# EAGLE schematic DeviceRelay8 (EAGLE 5.00)
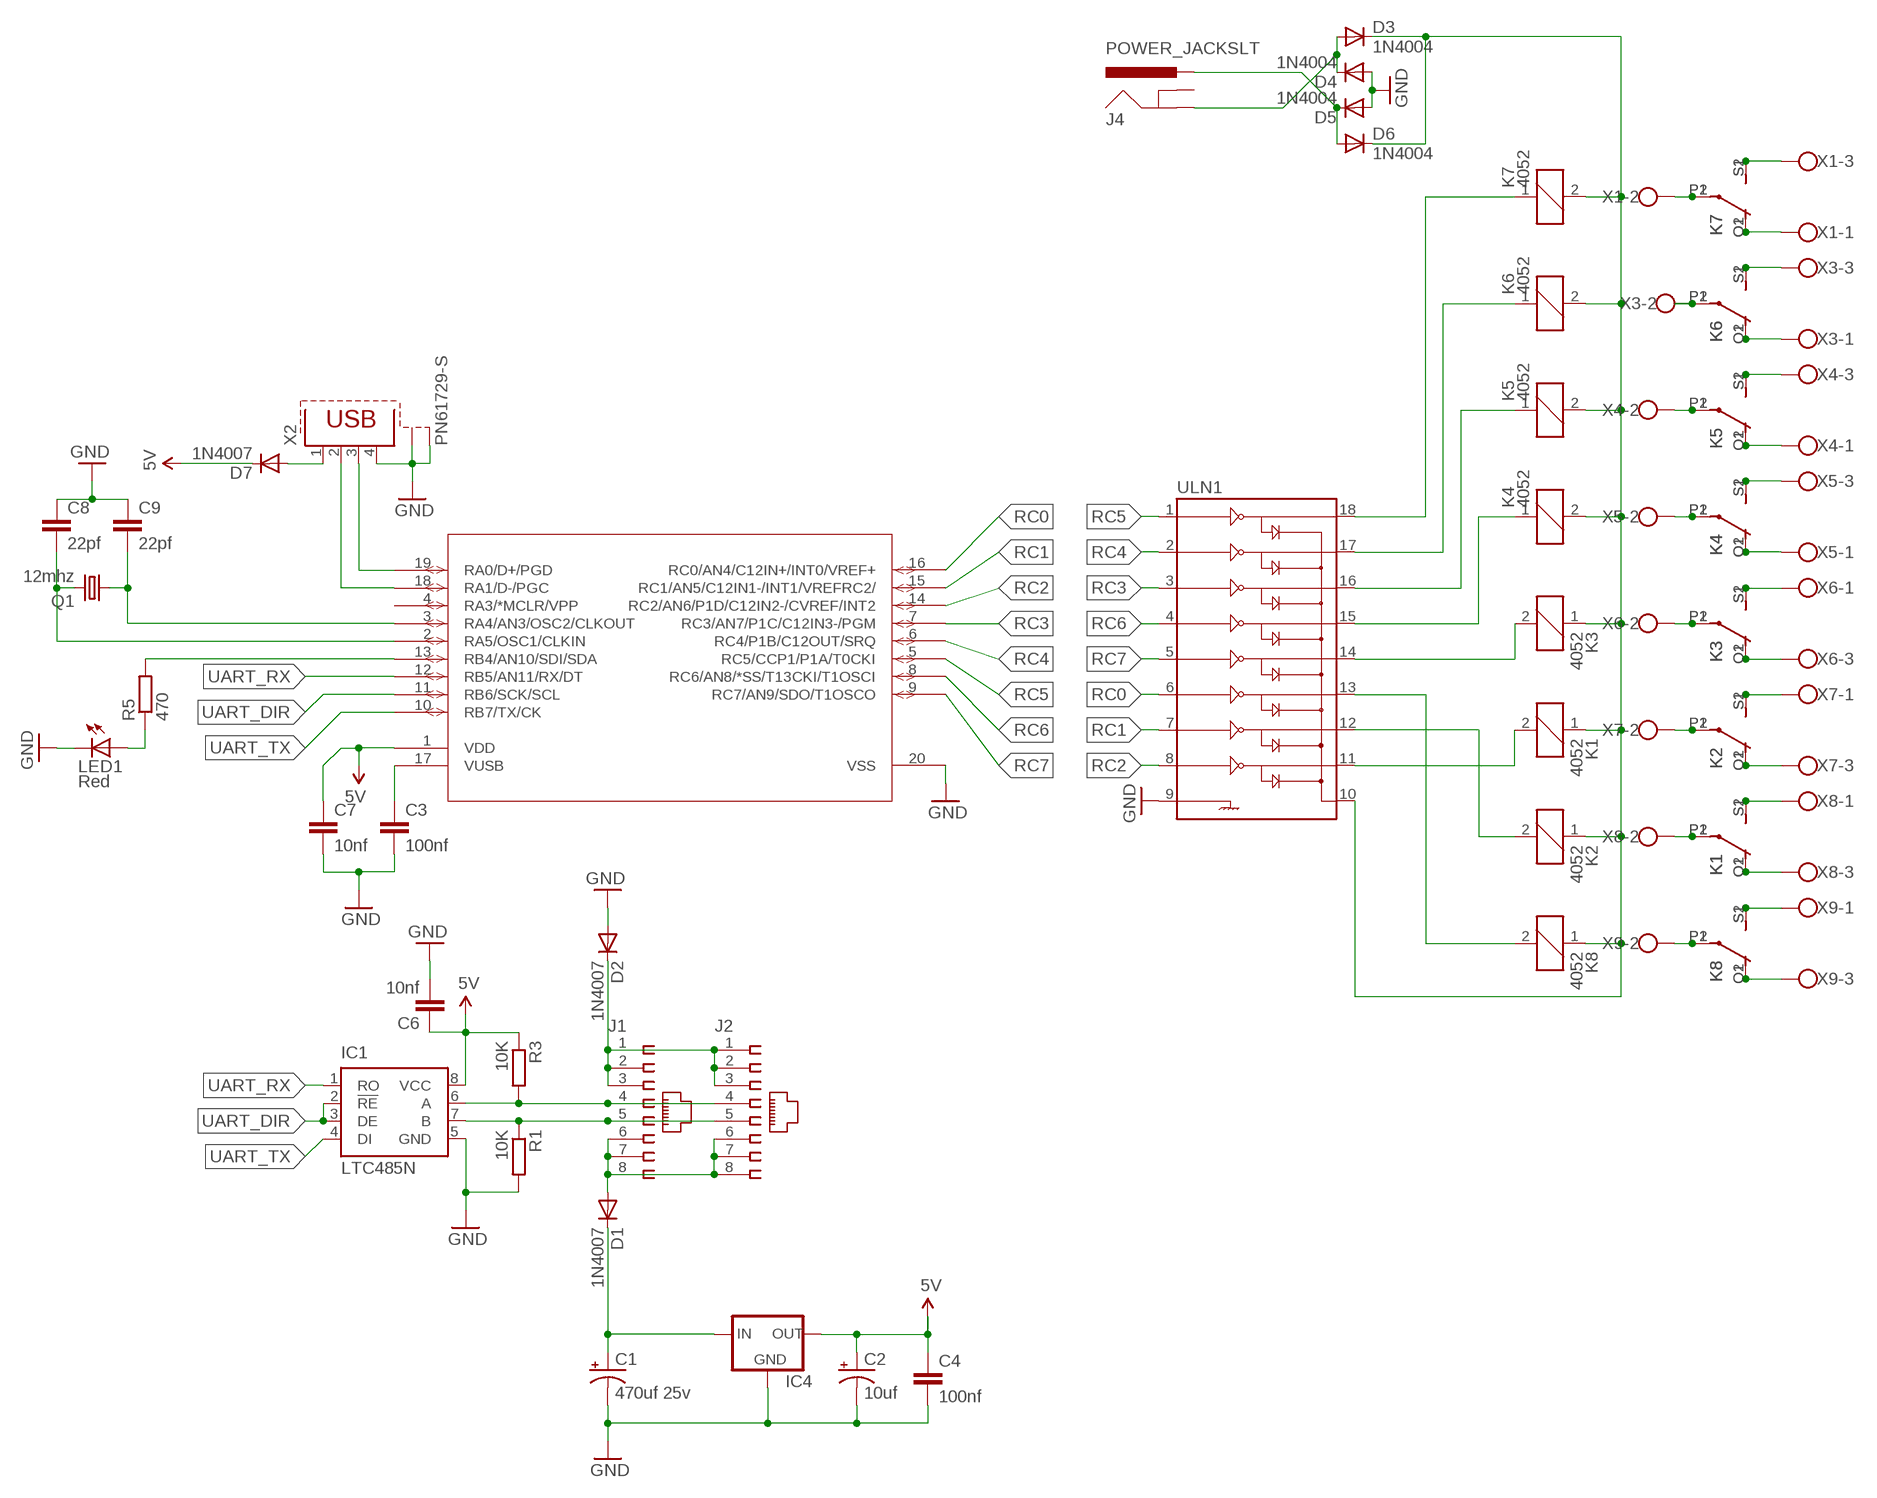
[diagram p0: schematic, sheet 1]

## Parts
C1  470uf 25v  CAP_POLPTH1  [CPOL-RADIAL-100UF-25V]
C2  10uf  CAP_POLPTH1  [CPOL-RADIAL-100UF-25V]
C3  100nf  C5/2.5  [C5B2.5]
C4  100nf  C5/2.5  [C5B2.5]
C6  10nf  C5/2.5  [C5B2.5]
C7  10nf  C5/2.5  [C5B2.5]
C8  22pf  C5/2.5  [C5B2.5]
C9  22pf  C5/2.5  [C5B2.5]
D1  1N4007  DIODE-D-7.5  [D-7.5]
D2  1N4007  DIODE-D-7.5  [D-7.5]
D3  1N4004  [DO41-10]
D4  1N4004  [DO41-10]
D5  1N4004  [DO41-10]
D6  1N4004  [DO41-10]
D7  1N4007  DIODE-D-7.5  [D-7.5]
IC1  LTC485N  [DIL08]
IC4  78XXL  [78XXL]
J1  215877-4  [215877-4]
J2  215877-4  [215877-4]
J4  POWER_JACKSLT  [POWER_JACK_SLOT]
K1  4052  [F4052]
K2  4052  [F4052]
K3  4052  [F4052]
K4  4052  [F4052]
K5  4052  [F4052]
K6  4052  [F4052]
K7  4052  [F4052]
K8  4052  [F4052]
LED1  Red  LED5MM  [LED5MM]
Q1  12mhz  CRYSTALHC49U-V  [HC49U-V]
R1  10K  R-EU_0204/5  [0204/5]
R3  10K  R-EU_0204/5  [0204/5]
R5  470  R-EU_0207/7  [0207/7]
U$2  PIC18F14K50-E-P  [PIC18F14K50-E/P]
ULN1  ULN2803DIP  [DIL18]
X1  W237-103  [W237-103]
X2  PN61729-S  [PN61729-S]
X3  W237-103  [W237-103]
X4  W237-103  [W237-103]
X5  W237-103  [W237-103]
X6  W237-103  [W237-103]
X7  W237-103  [W237-103]
X8  W237-103  [W237-103]
X9  W237-103  [W237-103]

## Nets
5V: C2.1(+) C4.1 C6.1 C7.1 D7.C IC1.8(VCC) IC4.OUT R3.1 U$2.1(VDD)
GND: C1.2(-) C2.2(-) C3.2 C4.2 C6.2 C7.2 C8.1 C9.1 D2.A D4.A D5.A IC1.5(GND) IC4.GND LED1.K(C) R1.2 U$2.20(VSS) ULN1.9 X2.4 X2.S1 X2.S2
N$1: LED1.A R5.1
N$2: D1.A J1.6 J1.7 J1.8 J2.6 J2.7 J2.8
N$3: IC1.6(A) J1.4 J2.4 R3.2
N$4: R5.2 U$2.13(RB4/AN10/SDI/SDA)
N$5: C1.1(+) D1.C IC4.IN
N$9: D2.C J1.1 J1.2 J1.3 J2.1 J2.2 J2.3
N$11: U$2.18(RA1/D-/PGC) X2.2
N$12: C3.1 U$2.17(VUSB)
N$13: U$2.19(RA0/D+/PGD) X2.3
N$14: K1.2 ULN1.11
N$15: D7.A X2.1
N$17: K8.2 ULN1.13
N$18: D5.C D6.A J4.PWR
N$20: K4.1 ULN1.15
N$21: K5.1 ULN1.16
N$22: K6.1 ULN1.17
N$23: K2.2 ULN1.12
N$24: K7.1 ULN1.18
N$25: K7.S1(2:S) K7.S2(3:S) X1.3
N$26: K7.O1(2:O) K7.O2(3:O) X1.1
N$27: K7.P1(2:P) K7.P2(3:P) X1.2
N$28: K6.P1(2:P) K6.P2(3:P) X3.2
N$29: K5.P1(2:P) K5.P2(3:P) X4.2
N$30: K4.P1(2:P) K4.P2(3:P) X5.2
N$31: K2.P1(2:P) K2.P2(3:P) X7.2
N$32: K1.P1(2:P) K1.P2(3:P) X8.2
N$33: K8.P1(2:P) K8.P2(3:P) X9.2
N$34: K8.O1(2:O) K8.O2(3:O) X9.3
N$35: K8.S1(2:S) K8.S2(3:S) X9.1
N$36: K1.S1(2:S) K1.S2(3:S) X8.1
N$37: K2.O1(2:O) K2.O2(3:O) X7.3
N$38: K2.S1(2:S) K2.S2(3:S) X7.1
N$39: K3.O1(2:O) K3.O2(3:O) X6.3
N$40: K6.O1(2:O) K6.O2(3:O) X3.1
N$41: K6.S1(2:S) K6.S2(3:S) X3.3
N$42: K1.O1(2:O) K1.O2(3:O) X8.3
N$43: K3.S1(2:S) K3.S2(3:S) X6.1
N$44: K4.O1(2:O) K4.O2(3:O) X5.1
N$45: K4.S1(2:S) K4.S2(3:S) X5.3
N$46: K5.O1(2:O) K5.O2(3:O) X4.1
N$47: K5.S1(2:S) K5.S2(3:S) X4.3
N$48: K3.P1(2:P) K3.P2(3:P) X6.2
N$50: IC1.7(B) J1.5 J2.5 R1.1
N$52: C8.2 Q1.2 U$2.2(RA5/OSC1/CLKIN)
N$53: C9.2 Q1.1 U$2.3(RA4/AN3/OSC2/CLKOUT)
N$54: K3.2 ULN1.14
N$57: D3.C D6.C K1.1 K2.1 K3.1 K4.2 K5.2 K6.2 K7.2 K8.1 ULN1.10
N$70: D3.A D4.C J4.GND@2(GND)
RC0: U$2.16(RC0/AN4/C12IN+/INT0/VREF+) ULN1.6
RC1: U$2.15(RC1/AN5/C12IN1-/INT1/VREFRC2/) ULN1.7
RC2: U$2.14(RC2/AN6/P1D/C12IN2-/CVREF/INT2) ULN1.8
RC3: U$2.7(RC3/AN7/P1C/C12IN3-/PGM) ULN1.3
RC4: U$2.6(RC4/P1B/C12OUT/SRQ) ULN1.2
RC5: U$2.5(RC5/CCP1/P1A/T0CKI) ULN1.1
RC6: U$2.8(RC6/AN8/*SS/T13CKI/T1OSCI) ULN1.4
RC7: U$2.9(RC7/AN9/SDO/T1OSCO) ULN1.5
UART_DIR: IC1.2(!RE) IC1.3(DE) U$2.11(RB6/SCK/SCL)
UART_RX: IC1.1(RO) U$2.12(RB5/AN11/RX/DT)
UART_TX: IC1.4(DI) U$2.10(RB7/TX/CK)
Unconnected: J4.GND@1(GNDBREAK) U$2.4(RA3/*MCLR/VPP)

## Library data of the parts
C1 C2 = SparkFun:CAP_POL: Capacitor Polarized These are standard SMD and PTH capacitors. Normally 10uF, 47uF, and 100uF in electrolytic and tantalum varieties. Always verify the external diameter of the through hole cap, it varies with capacity, voltage, and manufacturer. The EIA devices should be standard.
C3 C4 C6-C9 = capacitor-wima:C: CAPACITOR naming: grid - package width
D1 D2 D7 = diode:DIODE-: DIODE
D3-D6 = diode:1N4004: DIODE general purpose rectifier, 1 A
IC1 = linear-technology:LTC485: Low Power RS485 Interface Transceiver Source: http://www.linear.com/pc/downloadDocument.do?navId=H0,C1,C1007,C1017,P2064,D1718
IC4 = v-reg:78XXL: VOLTAGE REGULATOR
J1 J2 = con-amp:215877-4: AMP connector
J4 = SparkFun:POWER_JACK: Power Jack This is the standard 5.5mm barrel jack for power. The PTH is the most common, proven, reliable, footprint. All others are experimental. The Slot footprint only works if the mill layer is transmitted to the PCB fab house so be warned. Spark Fun Electronics SKU : PRT-00119. Mating wall wart : TOL-00298 (and others)
K1-K8 = relay:4052: RELAY 2 x switch, Finder
LED1 = led:LED: LED OSRAM: - CHIPLED LG R971, LG N971, LY N971, LG Q971, LY Q971, LO R971, LY R971 LH N974, LH R974 LS Q976, LO Q976, LY Q976 LO Q996 - Hyper CHIPLED LW Q18S LB Q993, LB Q99A, LB R99A - SideLED LS A670, LO A670, LY A670, LG A670, LP A670 LB A673, LV A673, LT A673, LW A673 LH A674 LY A675 LS A676, LA A676, LO A676, LY A676, LW A676 LS A679, LY A679, LG A679 - Hyper Micro SIDELED® LS Y876, LA Y876, LO Y876, LY Y876 LT Y87S - SmartLED LW L88C, LW L88S LB L89C, LB L89S, LG L890 LS L89K, LO L89K, LY L89K LS L896, LA L896, LO L896, LY L896 - TOPLED LS T670, LO T670, LY T670, LG T670, LP T670 LSG T670, LSP T670, LSY T670, LOP T670, LYG T670 LG T671, LOG T671, LSG T671 LB T673, LV T673, LT T673, LW T673 LH T674 LS T676, LA T676, LO T676, LY T676, LB T676, LH T676, LSB T676, LW T676 LB T67C, LV T67C, LT T67C, LS T67K, LO T67K, LY T67K, LW E67C LS E67B, LA E67B, LO E67B, LY E67B, LB E67C, LV E67C, LT E67C LW T67C LS T679, LY T679, LG T679 LS T770, LO T770, LY T770, LG T770, LP T770 LB T773, LV T773, LT T773, LW T773 LH T774 LS E675, LA E675, LY E675, LS T675 LS T776, LA T776, LO T776, LY T776, LB T776 LHGB T686 LT T68C, LB T68C - Hyper Mini TOPLED® LB M676 - Mini TOPLED Santana® LG M470 LS M47K, LO M47K, LY M47K Source: http://www.osram.convergy.de LUXEON: - LUMILED® LXK2-PW12-R00, LXK2-PW12-S00, LXK2-PW14-U00, LXK2-PW14-V00 LXK2-PM12-R00, LXK2-PM12-S00, LXK2-PM14-U00 LXK2-PE12-Q00, LXK2-PE12-R00, LXK2-PE12-S00, LXK2-PE14-T00, LXK2-PE14-U00 LXK2-PB12-K00, LXK2-PB12-L00, LXK2-PB12-M00, LXK2-PB14-N00, LXK2-PB14-P00, LXK2-PB14-Q00 LXK2-PR12-L00, LXK2-PR12-M00, LXK2-PR14-Q00, LXK2-PR14-R00 LXK2-PD12-Q00, LXK2-PD12-R00, LXK2-PD12-S00 LXK2-PH12-R00, LXK2-PH12-S00 LXK2-PL12-P00, LXK2-PL12-Q00, LXK2-PL12-R00 Source: www.luxeon.com KINGBRIGHT: KA-3528ASYC Source: www.kingbright.com
Q1 = crystal:CRYSTAL: CRYSTAL
R1 R3 = resistor:R-EU_: RESISTOR, European symbol
R5 = rcl:R-EU_: RESISTOR, European symbol
U$2 = pic18f14k50:PIC18F14K50-E-P
ULN1 = SparkFun:ULN2803: Darlington Driver ULN2803 Darlington array. 500mA max per channel, 8-channel package. Spark Fun Electronics SKU : COM-00312
X1 X3-X9 = con-wago-500:W237-103: WAGO SCREW CLAMP
X2 = con-berg:PN61729-S: BERG USB connector